# Altium schematic sheet MCU.SchDoc
size A3
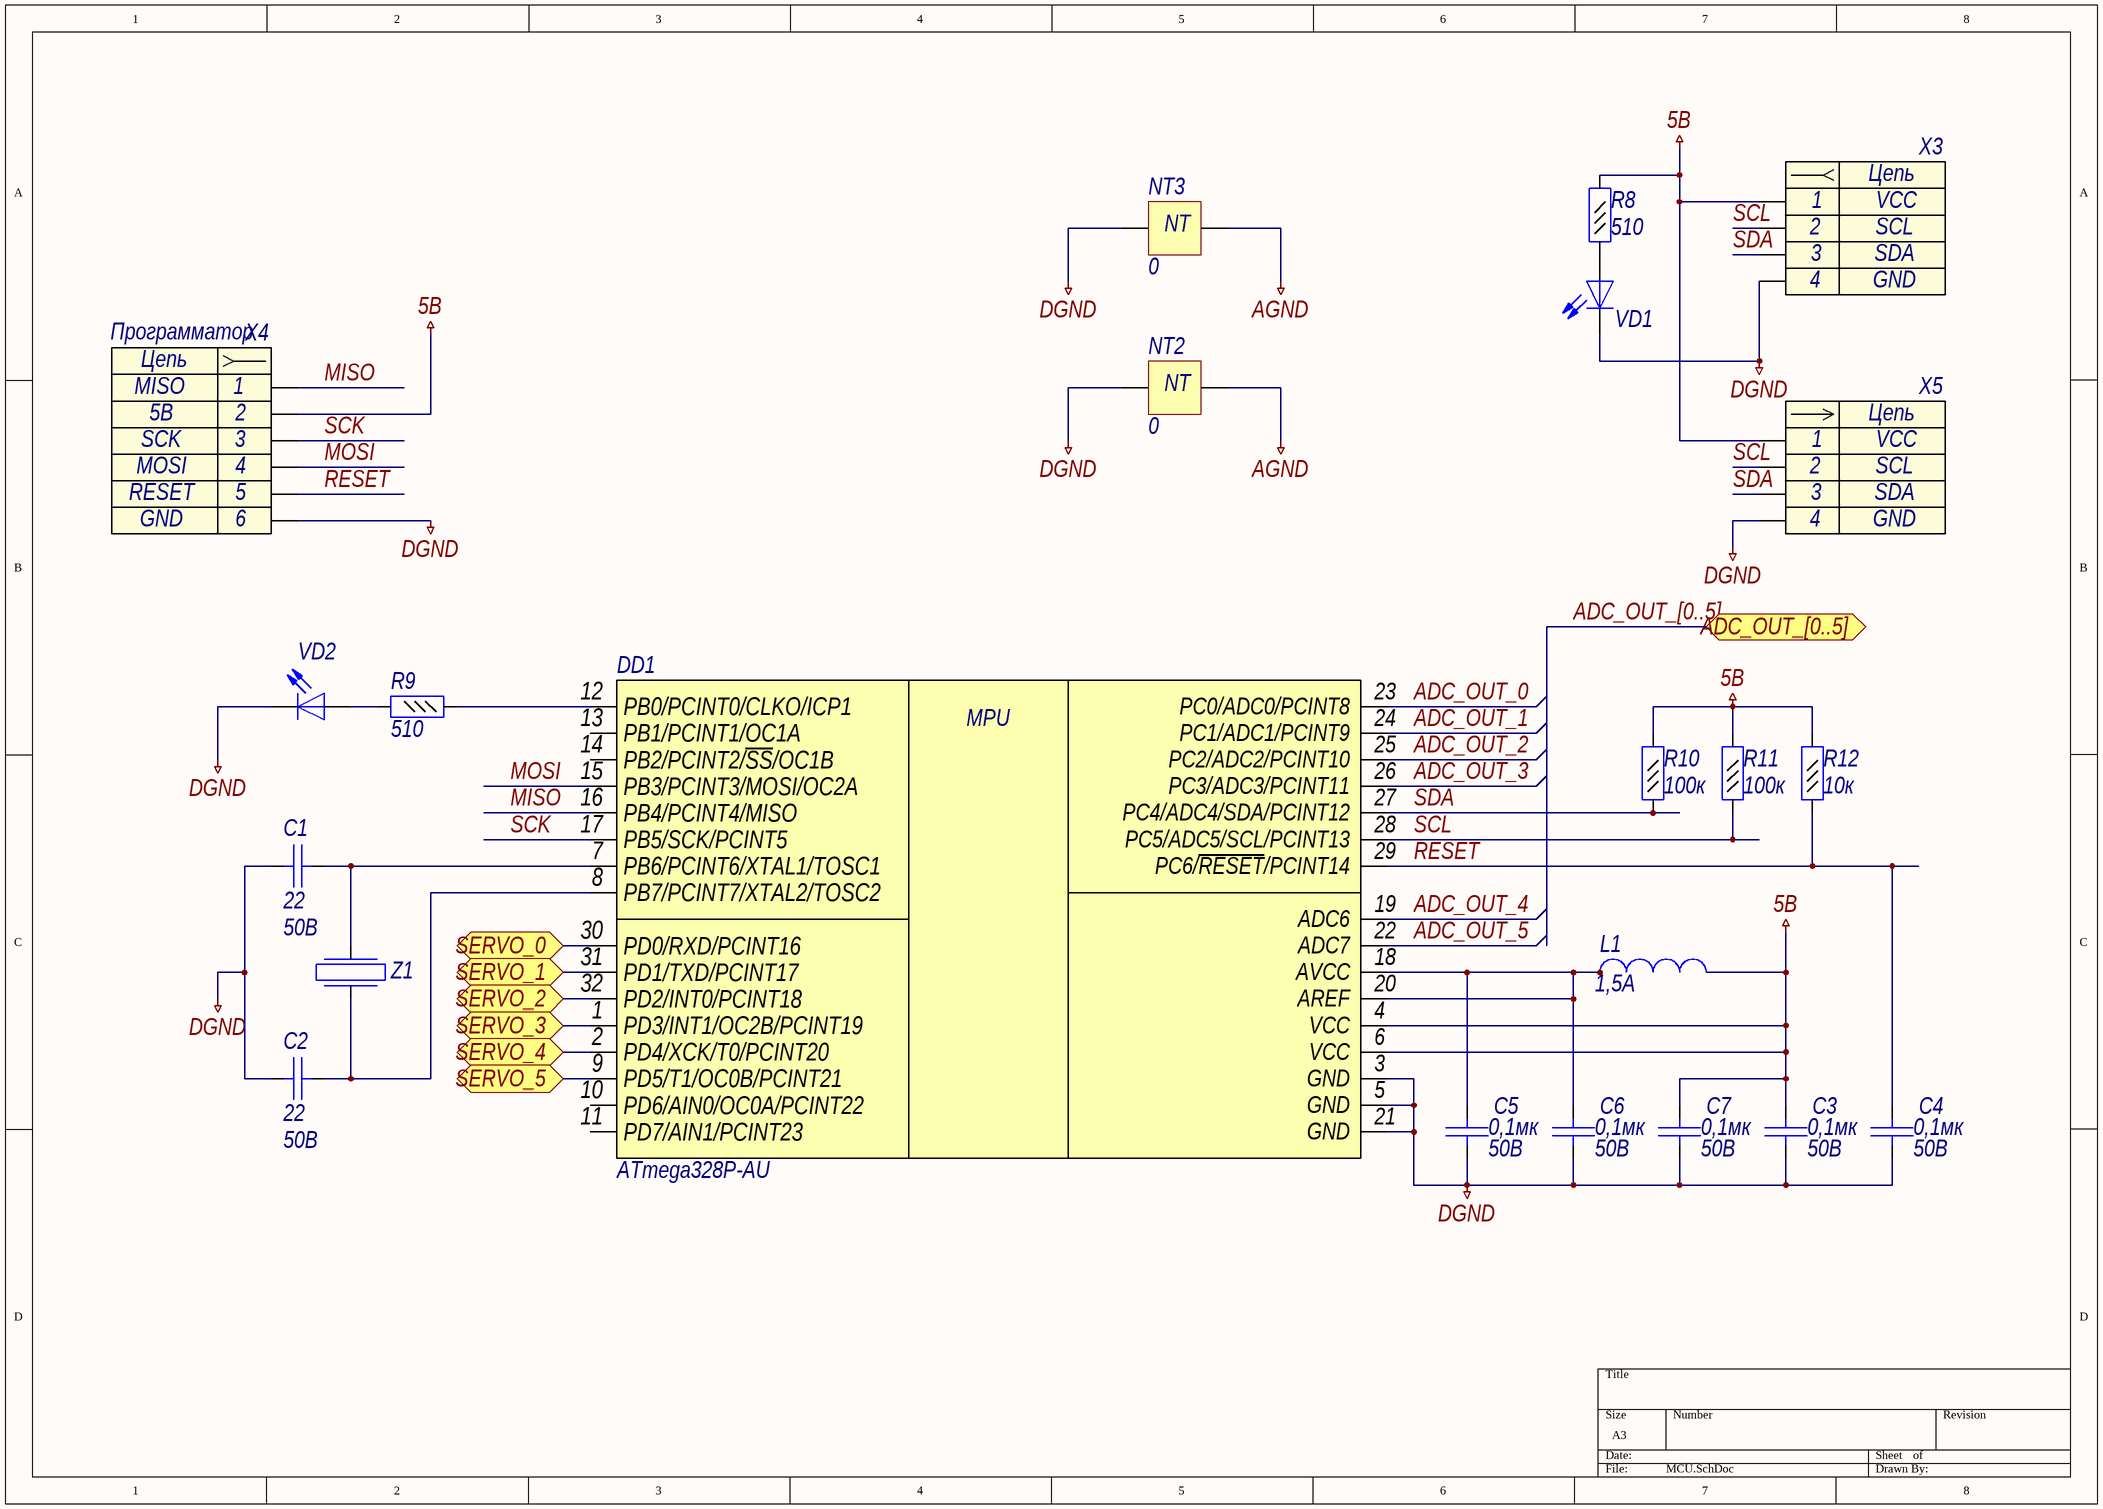
[diagram p0: MCU.SchDoc]

## Parts
C1  Voltage: 50B  [C0603]  (hidden comment: 22)
C2  Voltage: 50B  [C0603]  (hidden comment: 22)
C3  Voltage: 50B  [C0603]  (hidden comment: 0,1мк)
C4  Voltage: 50B  [C0603]  (hidden comment: 0,1мк)
C5  Voltage: 50B  [C0603]  (hidden comment: 0,1мк)
C6  Voltage: 50B  [C0603]  (hidden comment: 0,1мк)
C7  Voltage: 50B  [C0603]  (hidden comment: 0,1мк)
DD1  ATmega328P-AU  [TQFP-32]
L1  Rated Current: 1,5A  [L0603]  (hidden comment: Inductor)
NT2  value 0  [Pofigistor0603]  (hidden comment: Pofigistor)  (net tie, no BOM)
NT3  value 0  [Pofigistor0603]  (hidden comment: Pofigistor)  (net tie, no BOM)
R8  value 510  [R0603]  (hidden comment: Resistor_0,062Вт)
R9  value 510  [R0603]  (hidden comment: Resistor_0,062Вт)
R10  value 100к  [R0603]  (hidden comment: Resistor_0,062Вт)
R11  value 100к  [R0603]  (hidden comment: Resistor_0,062Вт)
R12  value 10к  [R0603]  (hidden comment: Resistor_0,062Вт)
VD1  LED  [L_0805]  (value not drawn)
VD2  LED  [L_0805]  (value not drawn)
X3  Header_4_sct  [RJ11_4P4C_V]  (value not drawn)
X4  Программатор  [PLS2-6]
X5  Header_4_plg  [PLS-4]  (value not drawn)
Z1  Crystal  [HC-49SM]  (value not drawn)

## Ports
ADC_OUT_[0..5], SERVO_0, SERVO_1, SERVO_2, SERVO_3, SERVO_4, SERVO_5

## Nets
5В: C3.2 C7.2 DD1.4(VCC) DD1.6(VCC) L1.2 R8.2 R10.2 R11.2 R12.2 X3.1 X4.2 X5.1
AGND: NT2.2 NT3.2
DGND: C1.1 C2.1 C3.1 C4.1 C5.1 C6.1 C7.1 DD1.3(GND) DD1.5(GND) DD1.21(GND) NT2.1 NT3.1 VD1.1(K) VD2.1(K) X3.4 X4.6 X5.4
ADC_OUT_0: DD1.23(PC0/ADC0/PCINT8)
ADC_OUT_1: DD1.24(PC1/ADC1/PCINT9)
ADC_OUT_2: DD1.25(PC2/ADC2/PCINT10)
ADC_OUT_3: DD1.26(PC3/ADC3/PCINT11)
ADC_OUT_4: DD1.19(ADC6)
ADC_OUT_5: DD1.22(ADC7)
MISO: DD1.16(PB4/PCINT4/MISO) X4.1
MOSI: DD1.15(PB3/PCINT3/MOSI/OC2A) X4.4
RESET: C4.2 DD1.29(PC6/~{RESET}/PCINT14) R12.1 X4.5
SCK: DD1.17(PB5/SCK/PCINT5) X4.3
SCL: DD1.28(PC5/ADC5/SCL/PCINT13) R11.1 X3.2 X5.2
SDA: DD1.27(PC4/ADC4/SDA/PCINT12) R10.1 X3.3 X5.3
SERVO_0: DD1.30(PD0/RXD/PCINT16) ; port SERVO_0
SERVO_1: DD1.31(PD1/TXD/PCINT17) ; port SERVO_1
SERVO_2: DD1.32(PD2/INT0/PCINT18) ; port SERVO_2
SERVO_3: DD1.1(PD3/INT1/OC2B/PCINT19) ; port SERVO_3
SERVO_4: DD1.2(PD4/XCK/T0/PCINT20) ; port SERVO_4
SERVO_5: DD1.9(PD5/T1/OC0B/PCINT21) ; port SERVO_5
NetC1_2: C1.2 DD1.7(PB6/PCINT6/XTAL1/TOSC1) Z1.2
NetC2_2: C2.2 DD1.8(PB7/PCINT7/XTAL2/TOSC2) Z1.1
NetC5_2: C5.2 C6.2 DD1.18(AVCC) DD1.20(AREF) L1.1
NetDD1_12: DD1.12(PB0/PCINT0/CLKO/ICP1) R9.1
NetR8_1: R8.1 VD1.2(A)
NetR9_2: R9.2 VD2.2(A)

Not connected (* = marked no-connect by the designer): DD1 10(PD6/AIN0/OC0A/PCINT22) 11(PD7/AIN1/PCINT23) 13(PB1/PCINT1/OC1A) 14(PB2/PCINT2/~{SS}/OC1B)

## Buses and harness runs
bus ADC_OUT_[0..5] = port ADC_OUT_[0..5]

## Notes on the sheet
- (in symbol connect0) Цепь
- (in symbol connect14) Цепь
- (in symbol connect73) Цепь
- (in symbol microcont1) MPU
- (in symbol res970) NT

## Library data of the parts
C1 C2 = cap77: Конденсатор; Part Name: Ceramic; Manufacture: Yageo; Part Number: CC0603JRNPO9BN220; id: cap77; TKE: NP0; Value: 22
C3-C7 = cap131: Конденсатор; Part Name: Ceramic; Manufacture: Murata; Part Number: GRM188R71H104KA93D; id: cap131; TKE: X7R; Value: 0,1мк
DD1 = microcont1: Микроконтроллер 8-Бит, picoPower, AVR, 20МГц, 32КБ Flash; Part Name: Microcontroller; Frequency: 20MHz; ADC: 8x10b; Interface: i2c, spi, uart; Flash: 32kb; Pin in: 23; Power Supply: 1.8-5.5 V; id: microcont1; Part Number: ATmega328P-AU
L1 = ind0: EMI Suppression Filter; Part Name: EMI Suppression Filters; Part Number: BLM18PG181SN1D; id: ind0; Resistance: 0,09Ohm
NT2 NT3 = res970: Part Name: NET TIE; id: res970
R8 R9 = res456: Резистор; Manufacture: Yageo; Part Number: RC0603FR-07510RL; id: res456; Accuracy: 0,01; Part Name: Resistor; Power: 0,062Вт
R10 R11 = res511: Резистор; Manufacture: Yageo; Part Number: RC0603FR-07100KL; id: res511; Accuracy: 0,01; Part Name: Resistor; Power: 0,062Вт
R12 = res487: Резистор; Manufacture: Yageo; Part Number: RC0603FR-0710KL; id: res487; Accuracy: 0,01; Part Name: Resistor; Power: 0,062Вт
VD1 VD2 = diode5: Светодиод; Part Number: KP-2012EC; id: diode5; Part Name: LED
X3 = connect73: Разъем - 4 конт. розетка; Part Name: Jack 4p4c (RJ11, RJ14) Vertical; Contact_1: VCC; Contact_2: SCL; Contact_3: SDA; Contact_4: GND; id: connect73
X4 = connect0: Разъем - 6 конт. розетка; Part Name: MKII; Contact_1: MISO; Contact_2: 5B; Contact_3: SCK; Contact_4: MOSI; Contact_5: RESET; Contact_6: GND; id: connect0
X5 = connect14: Разъем - 4 конт. вилка; Part Number: DS1021-1*4SF112-B; Manufacture: Ningbo connfly electronic; Contact_1: VCC; Contact_2: SCL; Contact_3: SDA; Contact_4: GND; Etch: 2,54mm; Part Name: PLS-4; id: connect14
Z1 = crystal16: Кварцевый резонатор; Manufacture: Китай; Part Number: 16.000MHzHC-49SM; Frequence: 16MHz; id: crystal16